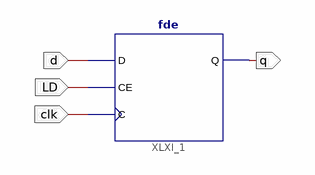
[diagram p0: schematic sheet 1]
// Xilinx ISE schematic RegParallelLoad_1.sch (spartan3e) as structural Verilog: 1 symbols, 4 ports
module RegParallelLoad_1 (
  input  d,
  input  LD,
  input  clk,
  output q
);

  fde XLXI_1 (.C(clk), .CE(LD), .D(d), .Q(q));
endmodule
